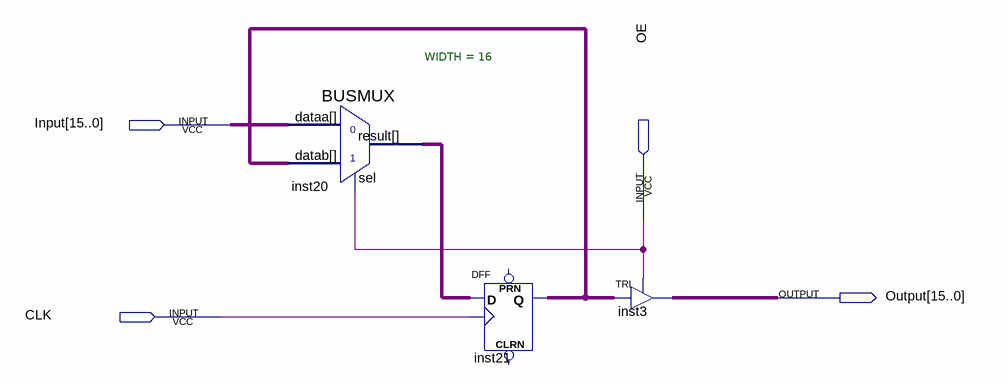
[diagram p0: schematic sheet]
// Quartus schematic REGOUT.bdf as structural Verilog: 3 symbols, 4 pins
module REGOUT (
  input  [15:0] Input,
  input  OE,
  input  CLK,
  output [15:0] Output
);

  wire [15:0] inst20_result, inst21_q;

  BUSMUX #(.WIDTH(16)) inst20 (.dataa(Input), .datab(inst21_q), .sel(OE), .result(inst20_result));
  DFF inst21[15:0] (.CLK(CLK), .D(inst20_result), .Q(inst21_q));  // open: CLRN, PRN
  TRI inst3[15:0] (.IN(inst21_q), .OE(OE), .OUT(Output));
endmodule
